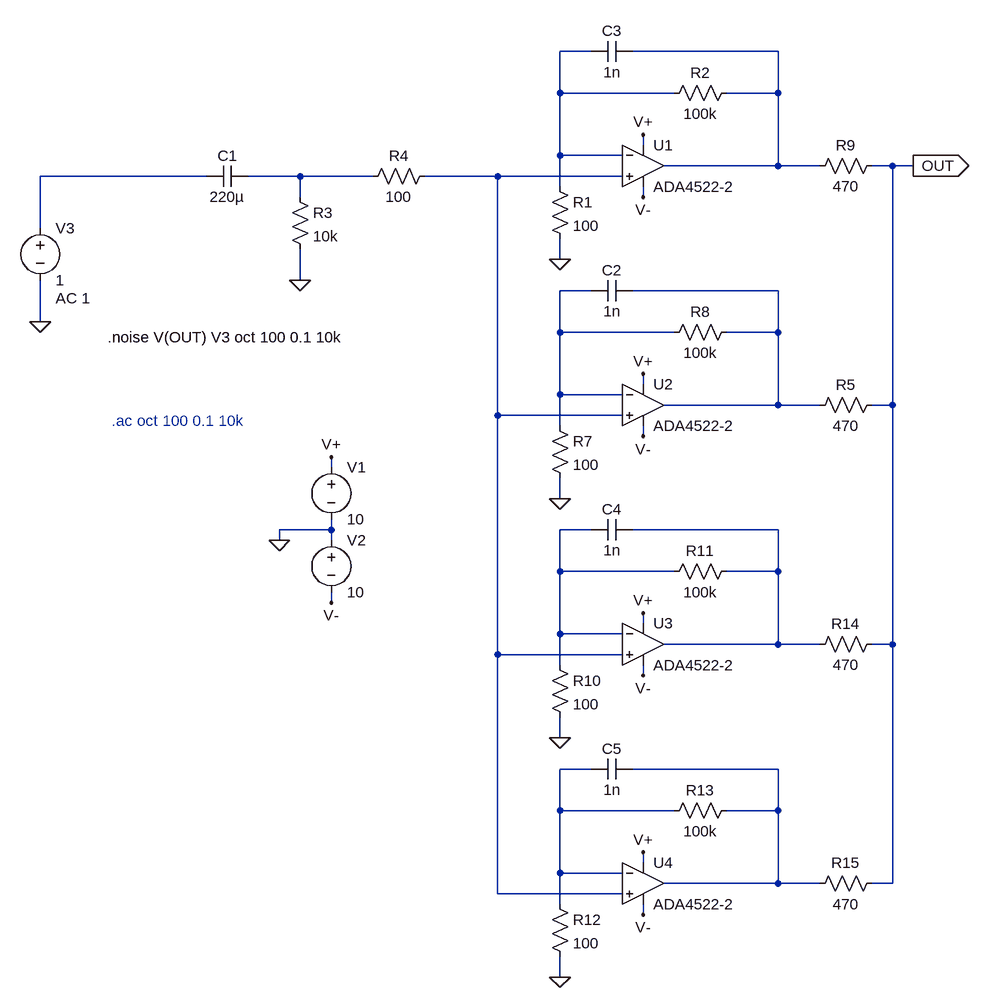
[diagram p0: schematic ADA4522-2.asc]
ADA4522-2.asc, the LTspice schematic file:
Version 4
SHEET 1 880 1620
WIRE 208 0 160 0
WIRE 496 0 272 0
WIRE 160 64 160 0
WIRE 336 64 160 64
WIRE 496 64 496 0
WIRE 496 64 416 64
WIRE 288 144 288 128
WIRE 160 160 160 64
WIRE 256 160 160 160
WIRE 496 176 496 64
WIRE 496 176 320 176
WIRE 560 176 496 176
WIRE 672 176 640 176
WIRE 704 176 672 176
WIRE -384 192 -640 192
WIRE -240 192 -320 192
WIRE -128 192 -240 192
WIRE 64 192 -48 192
WIRE 256 192 64 192
WIRE 160 208 160 160
WIRE -240 224 -240 192
WIRE 288 224 288 208
WIRE -640 272 -640 192
WIRE 160 320 160 288
WIRE -240 352 -240 304
WIRE 208 368 160 368
WIRE 496 368 272 368
WIRE -640 416 -640 352
WIRE 160 432 160 368
WIRE 336 432 160 432
WIRE 496 432 496 368
WIRE 496 432 416 432
WIRE 288 512 288 496
WIRE 160 528 160 432
WIRE 256 528 160 528
WIRE 496 544 496 432
WIRE 496 544 320 544
WIRE 560 544 496 544
WIRE 672 544 672 176
WIRE 672 544 640 544
WIRE 64 560 64 192
WIRE 256 560 64 560
WIRE 160 576 160 528
WIRE 288 592 288 576
WIRE -192 640 -192 624
WIRE 160 688 160 656
WIRE -192 736 -192 720
WIRE -192 736 -272 736
WIRE 208 736 160 736
WIRE 496 736 272 736
WIRE -272 752 -272 736
WIRE -192 752 -192 736
WIRE 160 800 160 736
WIRE 336 800 160 800
WIRE 496 800 496 736
WIRE 496 800 416 800
WIRE -192 848 -192 832
WIRE 288 880 288 864
WIRE 160 896 160 800
WIRE 256 896 160 896
WIRE 496 912 496 800
WIRE 496 912 320 912
WIRE 560 912 496 912
WIRE 672 912 672 544
WIRE 672 912 640 912
WIRE 64 928 64 560
WIRE 256 928 64 928
WIRE 160 944 160 896
WIRE 288 960 288 944
WIRE 160 1056 160 1024
WIRE 208 1104 160 1104
WIRE 496 1104 272 1104
WIRE 160 1168 160 1104
WIRE 336 1168 160 1168
WIRE 496 1168 496 1104
WIRE 496 1168 416 1168
WIRE 288 1248 288 1232
WIRE 160 1264 160 1168
WIRE 256 1264 160 1264
WIRE 496 1280 496 1168
WIRE 496 1280 320 1280
WIRE 560 1280 496 1280
WIRE 672 1280 672 912
WIRE 672 1280 640 1280
WIRE 64 1296 64 928
WIRE 256 1296 64 1296
WIRE 160 1312 160 1264
WIRE 288 1328 288 1312
WIRE 160 1424 160 1392
FLAG 704 176 OUT
IOPIN 704 176 Out
FLAG 160 320 0
FLAG -240 352 0
FLAG -272 752 0
FLAG -640 416 0
FLAG 160 688 0
FLAG 160 1056 0
FLAG 160 1424 0
FLAG -192 624 V+
FLAG -192 848 V-
FLAG 288 128 V+
FLAG 288 496 V+
FLAG 288 864 V+
FLAG 288 1232 V+
FLAG 288 224 V-
FLAG 288 592 V-
FLAG 288 960 V-
FLAG 288 1328 V-
SYMBOL voltage -192 624 R0
WINDOW 123 0 0 Left 0
WINDOW 39 0 0 Left 0
SYMATTR InstName V1
SYMATTR Value 10
SYMBOL res 144 192 R0
SYMATTR InstName R1
SYMATTR Value 100
SYMBOL res 432 48 R90
WINDOW 0 0 56 VBottom 2
WINDOW 3 32 56 VTop 2
SYMATTR InstName R2
SYMATTR Value 100k
SYMBOL res -256 208 R0
SYMATTR InstName R3
SYMATTR Value 10k
SYMBOL cap -320 176 R90
WINDOW 0 0 32 VBottom 2
WINDOW 3 32 32 VTop 2
SYMATTR InstName C1
SYMATTR Value 220µ
SYMBOL cap 272 -16 R90
WINDOW 0 0 32 VBottom 2
WINDOW 3 32 32 VTop 2
SYMATTR InstName C3
SYMATTR Value 1n
SYMBOL voltage -192 736 R0
WINDOW 123 0 0 Left 0
WINDOW 39 0 0 Left 0
SYMATTR InstName V2
SYMATTR Value 10
SYMBOL res -32 176 R90
WINDOW 0 0 56 VBottom 2
WINDOW 3 32 56 VTop 2
SYMATTR InstName R4
SYMATTR Value 100
SYMBOL voltage -640 256 R0
WINDOW 123 24 124 Left 2
WINDOW 39 0 0 Left 0
SYMATTR Value2 AC 1
SYMATTR InstName V3
SYMATTR Value 1
SYMBOL res 656 160 R90
WINDOW 0 0 56 VBottom 2
WINDOW 3 32 56 VTop 2
SYMATTR InstName R9
SYMATTR Value 470
SYMBOL OpAmps\\ADA4522-2 288 112 R0
SYMATTR InstName U1
SYMBOL res 144 560 R0
SYMATTR InstName R7
SYMATTR Value 100
SYMBOL res 432 416 R90
WINDOW 0 0 56 VBottom 2
WINDOW 3 32 56 VTop 2
SYMATTR InstName R8
SYMATTR Value 100k
SYMBOL cap 272 352 R90
WINDOW 0 0 32 VBottom 2
WINDOW 3 32 32 VTop 2
SYMATTR InstName C2
SYMATTR Value 1n
SYMBOL OpAmps\\ADA4522-2 288 480 R0
SYMATTR InstName U2
SYMBOL res 144 928 R0
SYMATTR InstName R10
SYMATTR Value 100
SYMBOL res 432 784 R90
WINDOW 0 0 56 VBottom 2
WINDOW 3 32 56 VTop 2
SYMATTR InstName R11
SYMATTR Value 100k
SYMBOL cap 272 720 R90
WINDOW 0 0 32 VBottom 2
WINDOW 3 32 32 VTop 2
SYMATTR InstName C4
SYMATTR Value 1n
SYMBOL OpAmps\\ADA4522-2 288 848 R0
SYMATTR InstName U3
SYMBOL res 144 1296 R0
SYMATTR InstName R12
SYMATTR Value 100
SYMBOL res 432 1152 R90
WINDOW 0 0 56 VBottom 2
WINDOW 3 32 56 VTop 2
SYMATTR InstName R13
SYMATTR Value 100k
SYMBOL cap 272 1088 R90
WINDOW 0 0 32 VBottom 2
WINDOW 3 32 32 VTop 2
SYMATTR InstName C5
SYMATTR Value 1n
SYMBOL OpAmps\\ADA4522-2 288 1216 R0
SYMATTR InstName U4
SYMBOL res 656 528 R90
WINDOW 0 0 56 VBottom 2
WINDOW 3 32 56 VTop 2
SYMATTR InstName R5
SYMATTR Value 470
SYMBOL res 656 896 R90
WINDOW 0 0 56 VBottom 2
WINDOW 3 32 56 VTop 2
SYMATTR InstName R14
SYMATTR Value 470
SYMBOL res 656 1264 R90
WINDOW 0 0 56 VBottom 2
WINDOW 3 32 56 VTop 2
SYMATTR InstName R15
SYMATTR Value 470
TEXT -536 440 Left 2 !.noise V(OUT) V3 oct 100 0.1 10k
TEXT -530 568 Left 2 ;.ac oct 100 0.1 10k

The netlist it stands for:
* ADA4522-2.asc
V1 V+ 0 10
R1 N001 0 100
R2 N002 N001 100k
R3 N004 0 10k
C1 N004 N003 220µ
C3 N002 N001 1n
V2 0 V- 10
R4 N005 N004 100
V3 N003 0 1 AC 1
R9 OUT N002 470
XU1 N005 N001 V+ V- N002 ADA4522  ; ADA4522-2, pins In+ In- V+ V- OUT
R7 N006 0 100
R8 N007 N006 100k
C2 N007 N006 1n
XU2 N005 N006 V+ V- N007 ADA4522  ; ADA4522-2, pins In+ In- V+ V- OUT
R10 N008 0 100
R11 N009 N008 100k
C4 N009 N008 1n
XU3 N005 N008 V+ V- N009 ADA4522  ; ADA4522-2, pins In+ In- V+ V- OUT
R12 N010 0 100
R13 N011 N010 100k
C5 N011 N010 1n
XU4 N005 N010 V+ V- N011 ADA4522  ; ADA4522-2, pins In+ In- V+ V- OUT
R5 OUT N007 470
R14 OUT N009 470
R15 OUT N011 470
.noise V(OUT) V3 oct 100 0.1 10k
* .ac oct 100 0.1 10k
.lib ADA4522.lib
.backanno
.end